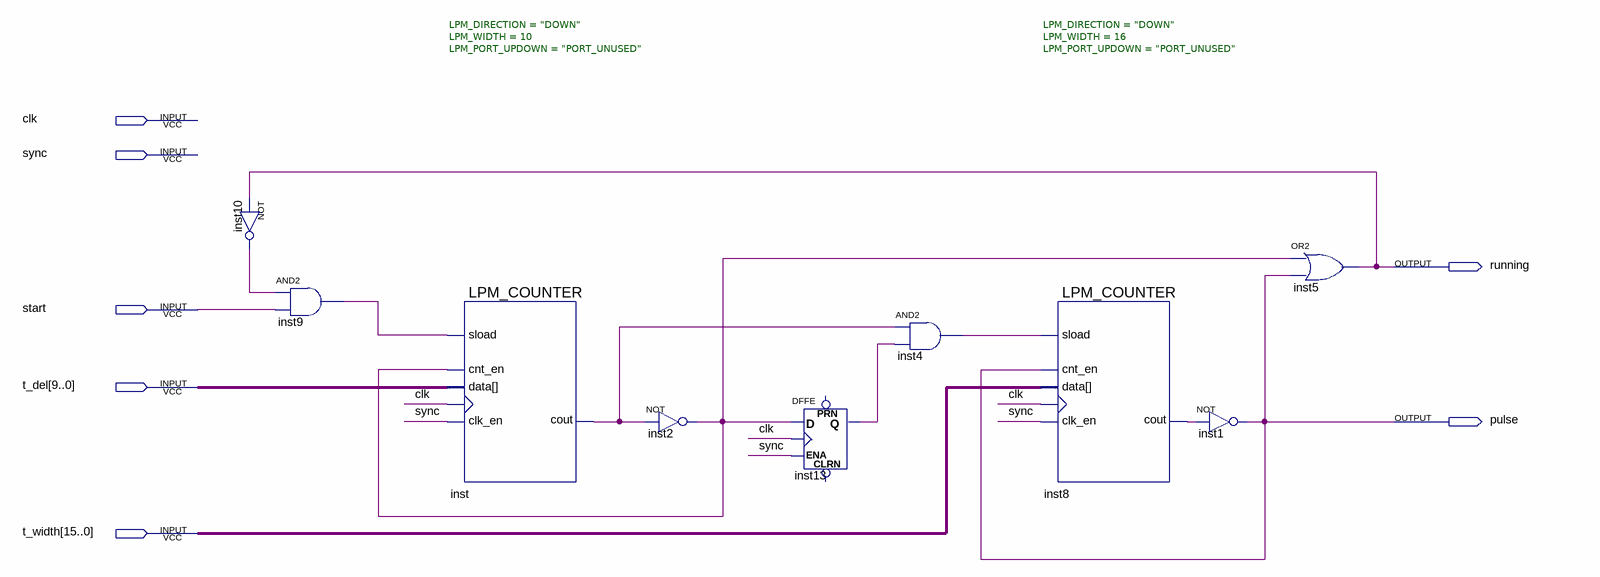
[diagram p0: schematic sheet]
// Quartus schematic dt_counter.bdf as structural Verilog: 9 symbols, 7 pins
module dt_counter (
  input  clk,
  input  sync,
  input  start,
  input  [9:0] t_del,
  input  [15:0] t_width,
  output running,
  output pulse
);

  wire inst2_out, inst4_out, inst8_cout, inst9_out, inst10_out, inst13_q, inst_cout;

  not inst10 (inst10_out, running);
  and inst9 (inst9_out, inst10_out, start);
  LPM_COUNTER #(.LPM_DIRECTION("DOWN"), .LPM_WIDTH(10), .LPM_PORT_UPDOWN("PORT_UNUSED")) inst (
    .sload(inst9_out), .cnt_en(inst2_out), .data(t_del), .clock(clk), .clk_en(sync), .cout(inst_cout));
  not inst2 (inst2_out, inst_cout);
  DFFE inst13 (.D(inst2_out), .CLK(clk), .ENA(sync), .Q(inst13_q));  // open: PRN, CLRN
  and inst4 (inst4_out, inst_cout, inst13_q);
  LPM_COUNTER #(.LPM_DIRECTION("DOWN"), .LPM_WIDTH(16), .LPM_PORT_UPDOWN("PORT_UNUSED")) inst8 (
    .sload(inst4_out), .cnt_en(pulse), .data(t_width), .clock(clk), .clk_en(sync), .cout(inst8_cout));
  not inst1 (pulse, inst8_cout);
  or inst5 (running, inst2_out, pulse);
endmodule
